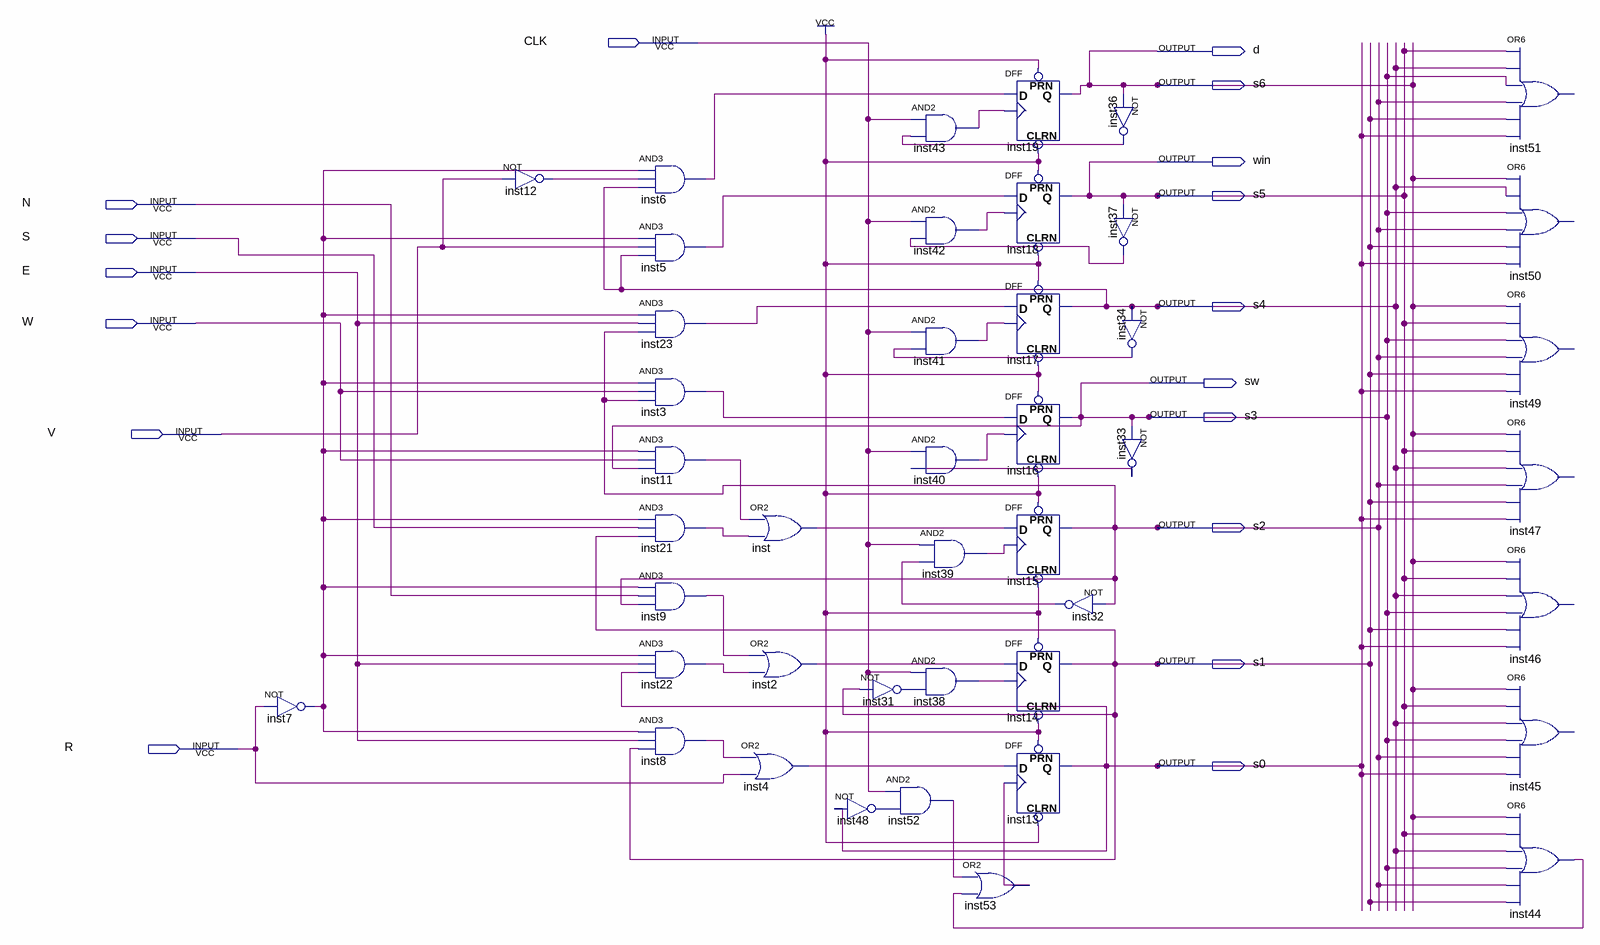
[diagram p0: schematic sheet]
// Quartus schematic room.bdf as structural Verilog: 43 symbols, 17 pins
module room (
  input  CLK,
  input  N,
  input  S,
  input  E,
  input  W,
  input  V,
  input  R,
  output d,
  output s6,
  output win,
  output s5,
  output s4,
  output sw,
  output s3,
  output s2,
  output s1,
  output s0
);

  wire inst2_out, inst3_out, inst4_out, inst5_out, inst6_out, inst7_out, inst8_out, inst9_out, inst11_out,
       inst12_out, inst21_out, inst22_out, inst23_out, inst31_out, inst32_out, inst33_out, inst34_out,
       inst36_out, inst37_out, inst38_out, inst39_out, inst40_out, inst41_out, inst42_out, inst43_out,
       inst44_out, inst48_out, inst52_out, inst53_out, inst_out;

  not inst7 (inst7_out, R);
  not inst12 (inst12_out, V);
  and inst6 (inst6_out, inst7_out, inst12_out, s4);
  and inst5 (inst5_out, inst7_out, V, s4);
  and inst23 (inst23_out, inst7_out, E, s2);
  and inst3 (inst3_out, inst7_out, W, s2);
  and inst11 (inst11_out, inst7_out, W, s3);
  and inst21 (inst21_out, inst7_out, S, s1);
  and inst9 (inst9_out, inst7_out, N, s2);
  and inst22 (inst22_out, inst7_out, E, s0);
  and inst8 (inst8_out, inst7_out, E, s1);
  or inst (inst_out, inst11_out, inst21_out);
  or inst2 (inst2_out, inst9_out, inst22_out);
  or inst4 (inst4_out, inst8_out, R);
  not inst31 (inst31_out, s1);
  and inst52 (inst52_out, CLK, inst48_out);
  not inst48 (inst48_out, s0);
  and inst43 (inst43_out, CLK, inst36_out);
  and inst42 (inst42_out, CLK, inst37_out);
  and inst41 (inst41_out, CLK, inst34_out);
  and inst40 (inst40_out, CLK, inst33_out);
  and inst39 (inst39_out, CLK, inst32_out);
  and inst38 (inst38_out, CLK, inst31_out);
  DFF inst19 (.CLRN(1'b1), .CLK(inst43_out), .D(inst6_out), .PRN(1'b1), .Q(d));
  DFF inst18 (.CLRN(1'b1), .CLK(inst42_out), .D(inst5_out), .PRN(1'b1), .Q(s5));
  DFF inst17 (.CLRN(1'b1), .CLK(inst41_out), .D(inst23_out), .PRN(1'b1), .Q(s4));
  DFF inst16 (.CLRN(1'b1), .CLK(inst40_out), .D(inst3_out), .PRN(1'b1), .Q(s3));
  DFF inst15 (.CLRN(1'b1), .CLK(inst39_out), .D(inst_out), .PRN(1'b1), .Q(s2));
  DFF inst14 (.CLRN(1'b1), .CLK(inst38_out), .D(inst2_out), .PRN(1'b1), .Q(s1));
  DFF inst13 (.CLRN(1'b1), .CLK(inst53_out), .D(inst4_out), .PRN(1'b1), .Q(s0));
  or inst53 (inst53_out, inst52_out, inst44_out);
  not inst32 (inst32_out, s2);
  not inst36 (inst36_out, d);
  not inst37 (inst37_out, s5);
  not inst34 (inst34_out, s4);
  not inst33 (inst33_out, s3);
  // OR6 inst51 has open pins: IN1=s5, IN2=s4, IN3=s3, IN4=s2, IN5=s1, IN6=s0, OUT=open
  // OR6 inst50 has open pins: IN1=d, IN2=s4, IN3=s3, IN4=s2, IN5=s1, IN6=s0, OUT=open
  // OR6 inst49 has open pins: IN1=d, IN2=s5, IN3=s3, IN4=s2, IN5=s1, IN6=s0, OUT=open
  // OR6 inst47 has open pins: IN1=d, IN2=s5, IN3=s4, IN4=s2, IN5=s1, IN6=s0, OUT=open
  // OR6 inst46 has open pins: IN1=d, IN2=s5, IN3=s4, IN4=s3, IN5=s1, IN6=s0, OUT=open
  // OR6 inst45 has open pins: IN1=d, IN2=s5, IN3=s4, IN4=s3, IN5=s2, IN6=s0, OUT=open
  or inst44 (inst44_out, d, s5, s4, s3, s2, s1);

  assign s6 = d;
  assign sw = s3;
  assign win = s5;
endmodule
